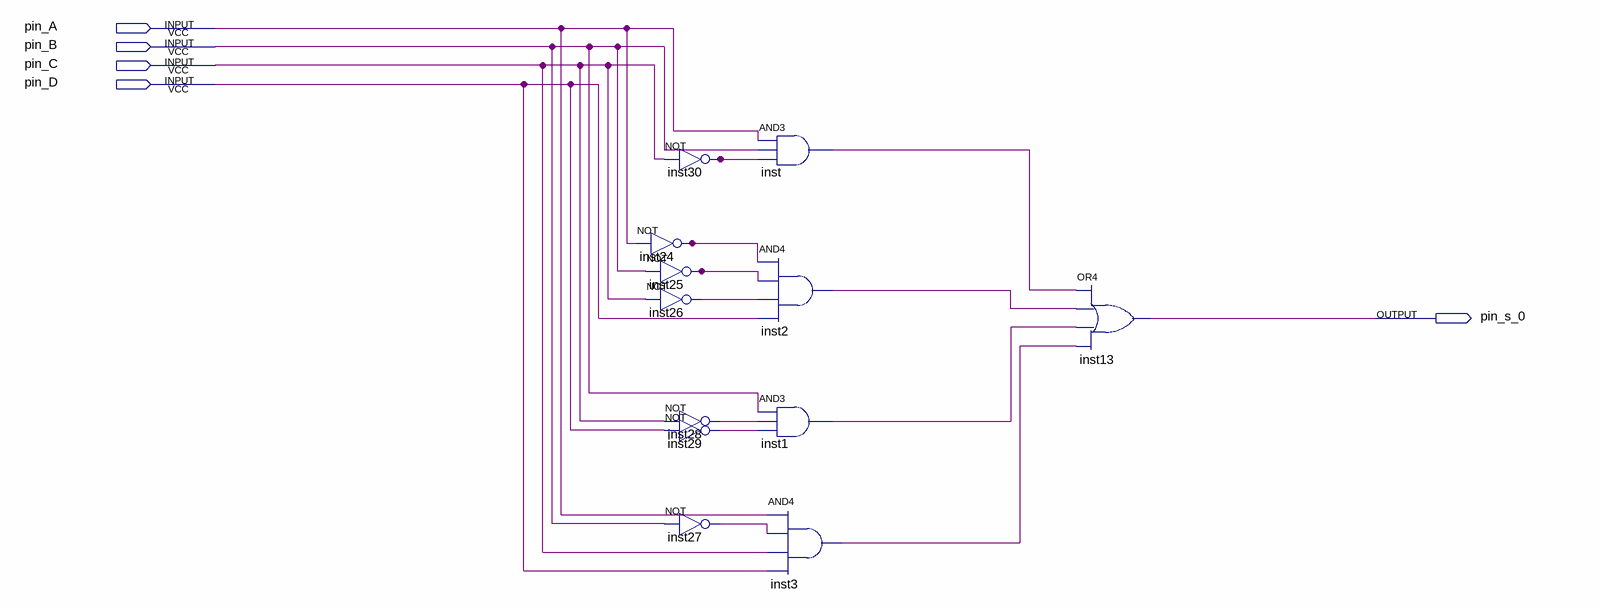
[diagram p0: schematic sheet]
// Quartus schematic s_0.bdf as structural Verilog: 12 symbols, 5 pins
module s_0 (
  input  pin_A,
  input  pin_B,
  input  pin_C,
  input  pin_D,
  output pin_s_0
);

  wire inst1_out, inst2_out, inst3_out, inst24_out, inst25_out, inst26_out, inst27_out, inst28_out,
       inst29_out, inst30_out, inst_out;

  not inst30 (inst30_out, pin_C);
  not inst24 (inst24_out, pin_A);
  not inst25 (inst25_out, pin_B);
  not inst26 (inst26_out, pin_C);
  not inst28 (inst28_out, pin_C);
  not inst29 (inst29_out, pin_D);
  not inst27 (inst27_out, pin_B);
  and inst (inst_out, pin_A, pin_B, inst30_out);
  and inst2 (inst2_out, inst24_out, inst25_out, inst26_out, pin_D);
  and inst1 (inst1_out, pin_B, inst28_out, inst29_out);
  and inst3 (inst3_out, pin_A, inst27_out, pin_C, pin_D);
  or inst13 (pin_s_0, inst_out, inst2_out, inst1_out, inst3_out);
endmodule
